# Altium schematic sheet MCU_IMU.SchDoc
size A; SheetNumber: 1; SheetTotal: 4
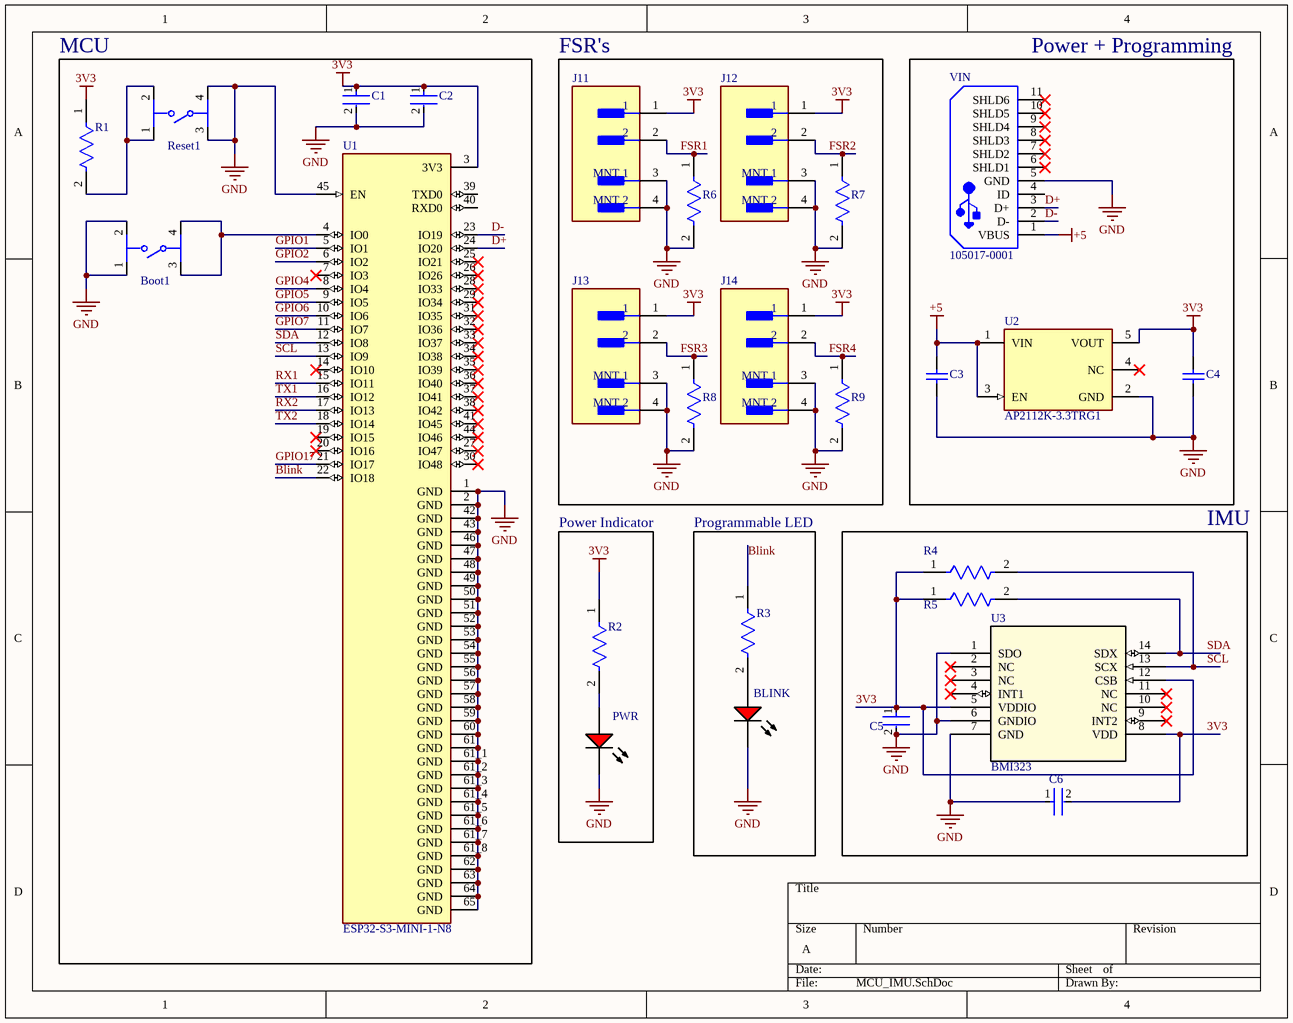
[diagram p0: MCU_IMU.SchDoc]

## Parts
BLINK  SML-LX1206IC-TR  [LUMX-SML-LX1206IC_V]  (value not drawn)
Boot1  PTS810SJM250SMTRLFS  [FP-PTS810SJM250SMTRLFS-MFG]  (value not drawn)
C1  CC0805KRX7R9BB104  [FP-CC0805-0_85-MFG]  (value not drawn)
C2  CC0805KRX7R9BB104  [FP-CC0805-0_85-MFG]  (value not drawn)
C3  C0805C105K5RACTU  [CAPC2013X140X50ML20T25]  (value not drawn)
C4  C0805C105K5RACTU  [CAPC2013X140X50ML20T25]  (value not drawn)
C5  CC0805KRX7R9BB104  [FP-CC0805-0_85-MFG]  (value not drawn)
C6  CC0805KRX7R9BB104  [FP-CC0805-0_85-MFG]  (value not drawn)
J11  BM02B-SRSS-TBT(LF)(SN)  [FP-BM02B-SRSS-TBT_LF_SN-MFG]  (value not drawn)
J12  BM02B-SRSS-TBT(LF)(SN)  [FP-BM02B-SRSS-TBT_LF_SN-MFG]  (value not drawn)
J13  BM02B-SRSS-TBT(LF)(SN)  [FP-BM02B-SRSS-TBT_LF_SN-MFG]  (value not drawn)
J14  BM02B-SRSS-TBT(LF)(SN)  [FP-BM02B-SRSS-TBT_LF_SN-MFG]  (value not drawn)
PWR  SML-LX1206IC-TR  [LUMX-SML-LX1206IC_V]  (value not drawn)
R1  CRCW08054K70FKEA  [FP-CRCW0805-e3-IPC_B]  (value not drawn)
R2  CRCW08054K70FKEA  [FP-CRCW0805-e3-IPC_B]  (value not drawn)
R3  CRCW08054K70FKEA  [FP-CRCW0805-e3-IPC_B]  (value not drawn)
R4  CRCW08054K70FKEA  [FP-CRCW0805-e3-IPC_B]  (value not drawn)
R5  CRCW08054K70FKEA  [FP-CRCW0805-e3-IPC_B]  (value not drawn)
R6  RC0603FR-0710KL  [FP-RC0603-0_55-IPC_C]  (value not drawn)
R7  RC0603FR-0710KL  [FP-RC0603-0_55-IPC_C]  (value not drawn)
R8  RC0603FR-0710KL  [FP-RC0603-0_55-IPC_C]  (value not drawn)
R9  RC0603FR-0710KL  [FP-RC0603-0_55-IPC_C]  (value not drawn)
Reset1  PTS810SJM250SMTRLFS  [FP-PTS810SJM250SMTRLFS-MFG]  (value not drawn)
U1  ESP32-S3-MINI-1-N8  [XCVR_ESP32-S3-MINI-1-N8]
U2  AP2112K-3.3TRG1  [FP-SOT25-IPC_A]
U3  BMI323  [BMI323_BOS]
VIN  105017-0001  [USB-MICRO-B_V]

## Blocks framed on the sheet
MCU: Boot1 C1 C2 R1 Reset1 U1
FSR's: J11-J14 R6-R9
Power + Programming: C3 C4 U2 VIN
Power Indicator: PWR R2
Programmable LED: BLINK R3
IMU: C5 C6 R4 R5 U3

## Nets
3V3: C1.1 C2.1 C4.2 C5.1 C6.2 J11.1 J12.1 J13.1 J14.1 R1.1 R2.1 R4.1 R5.1 U1.3(3V3) U2.5(VOUT) U3.5(VDDIO) U3.8(VDD) U3.12(CSB)
+5: C3.2 U2.1(VIN) U2.3(EN) VIN.1(VBUS)
GND: BLINK.2(K) Boot1.1 Boot1.2 C1.2 C2.2 C3.1 C4.1 C5.2 C6.1 J11.3(MNT_1) J11.4(MNT_2) J12.3(MNT_1) J12.4(MNT_2) J13.3(MNT_1) J13.4(MNT_2) J14.3(MNT_1) J14.4(MNT_2) PWR.2(K) R6.2 R7.2 R8.2 R9.2 Reset1.3 Reset1.4 U1.1(GND) U1.2(GND) U1.42(GND) U1.43(GND) U1.45(EN) U1.46(GND) U1.47(GND) U1.48(GND) U1.49(GND) U1.50(GND) U1.51(GND) U1.52(GND) U1.53(GND) U1.54(GND) U1.55(GND) U1.56(GND) U1.57(GND) U1.58(GND) U1.59(GND) U1.60(GND) U1.61(GND) U1.61_1(GND) U1.61_2(GND) U1.61_3(GND) U1.61_4(GND) U1.61_5(GND) U1.61_6(GND) U1.61_7(GND) U1.61_8(GND) U1.62(GND) U1.63(GND) U1.64(GND) U1.65(GND) U2.2(GND) U3.1(SDO) U3.6(GNDIO) U3.7(GND) VIN.5(GND)
Blink: R3.1 U1.22(IO18)
D+: U1.24(IO20) VIN.3(D+)
D-: U1.23(IO19) VIN.2(D-)
FSR1: J11.2 R6.1
FSR2: J12.2 R7.1
FSR3: J13.2 R8.1
FSR4: J14.2 R9.1
GPIO1: U1.5(IO1)
GPIO2: U1.6(IO2)
GPIO4: U1.8(IO4)
GPIO5: U1.9(IO5)
GPIO6: U1.10(IO6)
GPIO7: U1.11(IO7)
GPIO17: U1.21(IO17)
RX1: U1.15(IO11)
RX2: U1.17(IO13)
SCL: R4.2 U1.13(IO9) U3.13(SCX)
SDA: R5.2 U1.12(IO8) U3.14(SDX)
TX1: U1.16(IO12)
TX2: U1.18(IO14)
NetBLINK_1: BLINK.1(A) R3.2
NetBoot1_3: Boot1.3 Boot1.4 U1.4(IO0)
NetPWR_1: PWR.1(A) R2.2
NetR1_2: R1.2 Reset1.1 Reset1.2

Not connected (* = marked no-connect by the designer): U1 7(IO3)* 14(IO10)* 19(IO15)* 20(IO16)* 25(IO21)* 26(IO26)* 27(IO47)* 28(IO33)* 29(IO34)* 30(IO48)* 31(IO35)* 32(IO36)* 33(IO37)* 34(IO38)* 35(IO39)* 36(IO40)* 37(IO41)* 38(IO42)* 39(TXD0) 40(RXD0) 41(IO45)* 44(IO46)*; U2 4(NC)*; U3 2(NC)* 3(NC)* 4(INT1)* 9(INT2)* 10(NC)* 11(NC)*; VIN 4(ID) 6(SHLD1)* 7(SHLD2)* 8(SHLD3)* 9(SHLD4)* 10(SHLD5)* 11(SHLD6)*

## Library data of the parts
BLINK PWR = CMP-2000-07123-1: LED Red, 65 mW, -40 to 85 degC, 2-Pin SMD, RoHS, Tape and Reel; Manufacturer: Lumex; LED Material: GaAsP; Peak Wavelength: 635nm; Number of LEDs: 1; Viewing Angle: 160; Reverse Voltage: 5(Min)V; Lens Appearance: ColorlessNonDiffused; Intensity: 6mcd; Pin_Count: 2; Lens Dimensions: 2x1.6x0.5mm; Mounting: SurfaceMount; ECCN: EAR99; RoHS: Unknown; Package Description: 2-Pin Surface Mount Device, Body 3.2 x 1.5 mm; Mounting Technology: SurfaceMount; Dominant Wavelength: N/A; Supplier_Package: SMD; Supplier Standard Pack: 3,000; Color: Red; Dimension: 3.2x1.6x1.1mm; HTS: 8541402000; Part No: SML-LX1206IC-TR; Family: SML-LX1206IC; Supplier: Lumex; Datasheet URL: http://www.lumex.com/content/files/ProductAttachment/SML-LX1206IC-TR.pdf; Package Reference: SML-LX1206IC; Manufacturer URL: http://www.lumexinstruments.com/; Type: Uni-Color; Operating Temperature: -25to85C; Packaging: TapeandReel; Datasheet Version: Rev. J, 08/2012
Boot1 Reset1 = CMP-10040-000001-2: SWITCH TACTILE SPST-NO 0.05A 16V; Throw Configuration: SPST; Operating Force: 160gf; Actuator Type: Standard; Switch Travel: 0.15mm; Switch Function: Off-Mom; Max Current Rating: 50mA; Mechanical Life: 150000Cycles; Illumination Type: Non-Illuminated; Package Quantity: 2900; Depth: 4.6mm; Mount: Surface Mount; Packaging: Tape and Reel; Length: 3.2mm; RoHS Compliant: Yes; Case/Package: SMD/SMT; Voltage Rating (DC): 16V; Min Operating Temperature: -40°C; Termination: J-Bend; Lead Free: Lead Free; Contact Plating: Silver; Orientation: Straight; Max Operating Temperature: 85°C; Current Rating: 50mA; Color: Black
C1 C2 C5 C6 = CMP-2100-03606-3: CAP CER 0.1UF 50V X7R 0805; Manufacturer: Yageo; Tolerance: 0.1; Capacitance: 100 nF; Value: 100 nF; Material: Ceramic; Device Class L1: Passive Components; ComponentLink2Description: Datasheet; Package: CC0805-0.85; Manufacturer Part Number: CC0805KRX7R9BB104; Digikey Description: CAP CER 0.1UF 50V X7R 0805; Device Class L3: Ceramic Capacitors; Temperature: -30°C to +85°C; Temperature Characteristic: X7R; Voltage Rating: 50 V; Height: 0.95mm; RoHS: TRUE; Ipc Land Pattern Name: CAPC200125X85; Device Class L2: Capacitors; Category: Cap; Temperature Range Low: -30°C; Temperature Range High: +85°C; Mouser Description: Multilayer Ceramic Capacitors MLCC - SMD/SMT 100nF 50V X7R 10%; Footprint Url: http://www.yageo.com/exep/pages/download/literatures/UPY-C_GEN_24.pdf; Automotive: No; Octopart: https://octopart.com/cc0805krx7r9bb104-yageo-192993; Lead Free: Yes; ComponentLink2URL: http://www.yageo.com/documents/recent/UPY-GPHC_Y5V_6.3V-to-50V_8.pdf
C3 C4 = CMP-2007-03236-1: Manufacturer: Kemet; Part Number: C0805C105K5RACTU
J11-J14 = CMP-17439-000179-1: CONN WIRE HDR 2POS 1MM STSMD; Mated Stacking Heights: 4.9mm; Max Current Rating: 1A; Pitch: 0.039inch; Contact Resistance: 20mR; Max Voltage Rating (DC): 50V; Connector Type: Header; Number of Positions: 2; Insulation Material: Nylon; Termination: Solder; Contact Plating: Tin; Mount: Surface Mount; Package Quantity: 1500; Housing Color: Natural; Orientation: Straight; Max Operating Temperature: 85°C; Min Operating Temperature: -25°C; Length: 4mm; Lead Free: Lead Free; Contact Type: Male Pin; Depth: 3.6mm; Contact Material: Copper Alloy; Packaging: Tape and Reel; Number of Rows: 1; Contact Shape: Square; Flammability Rating: UL94 V-0; Voltage Rating: 50V; Color: Natural; Contact Finish - Mating: TIN; Fastening Type: Pull; Insulation Color: Natural; Series: SR; Max Voltage Rating (AC): 50V; Housing Material: Polyamide
R1-R5 = CMP-2100-03615-2: RES Thick Film, 4.7kΩ, 1%, 0.125W, 100ppm/°C, 0805; Max Power Dissipation: 125mW; Resistance: 4.7kR; Voltage Rating: 150V; Termination: SMD/SMT; Weight: 0.000194oz; Case/Package: 0805; Number of Terminations: 2; Min Operating Temperature: -55°C; Case Code (Metric): 2012; Package Quantity: 10; Depth: 1.25mm; Military Standard: Not; Composition: Thick Film; Radiation Hardening: No; Contact Plating: Tin; Height: 0.45mm; Power Rating: 125mW; Features: Automotive AEC-Q200; Tolerance: 1%; Packaging: Tape and Reel; Max Operating Temperature: 155°C; Length: 2mm; Case Code (Imperial): 0805; Voltage Rating (DC): 150V; Width: 1.25mm; Temperature Coefficient: 100ppm/°C; Lead Free: Lead Free
R6-R9 = CMP-2100-03664-2: RES 10K OHM 1% 1/10W 0603; Voltage Rating: 75V; Voltage Rating (DC): 50V; Resistance: 10kR; Power Rating: 100mW; Temperature Coefficient: 100ppm/°C; Depth: 0.8mm; Termination: SMD/SMT; Resistor Type: Thick Film; Series: RC; Construction: Rectangular; Features: Moisture Resistant; Packaging: Tape and Reel; Min Operating Temperature: -55°C; Number of Terminations: 2; Lead Pitch: 0.3mm; RoHS Compliant: Yes; Case/Package: 0603; Resistance Tolerance: 1%; Military Standard: Not; Weight: 7.1E-05oz; Number of Pins: 2; Tolerance: 1%; Length: 1.6mm; Case Code (Imperial): 0603; Lead Free: Lead Free; Width: 0.8mm; Max Power Dissipation: 100mW; Height: 0.45mm; Max Operating Temperature: 155°C; Case Code (Metric): 1608; Size Code: 0603
U1 = CMP-025-000000-2: MF: {'manufacturer': u'Espressif Systems'}; Pin Count: 73; Component Type: Standard; Design Item ID: ESP32-S3-MINI-1-N8; Source: ESP32-S3-MINI-1-N8.SchLib; MP: ESP32-S3-MINI-1-N8; Price: None; Package: None; Value: *
U2 = CMP-12756-000035-1: IC REG LINEAR 3.3V 600MA SOT25; Number of Regulators: 1; Output Type: Fixed; Polarity: Positive; Min Input Voltage: 2.5V; Max Input Voltage: 6V; Accuracy: 1.5%; Quiescent Current: 55uA; Dropout Voltage: 250mV; Min Operating Temperature: -40°C; Length: 3.1mm; Output Current: 600mA; Max Operating Temperature: 85°C; Package Quantity: 1; Output Voltage: 3.3V; Width: 1.7mm; Number of Outputs: 1; Packaging: Tape and Reel; Height: 1.3mm; Lead Free: Lead Free; Max Output Current: 600mA; Case/Package: SOT-23-5; Mount: Surface Mount; Number of Pins: 5
U3 = BMI323: No Description Available; Manufacturer_Name: Bosch Sensortec; Copyright: Copyright (C) 2025 Ultra Librarian. All rights reserved.; Manufacturer_Part_Number: BMI323; RefDes: RefDes; Type: Type
VIN = CMP-2000-05827-1: Micro-USB B Receptacle, Right Angle, Bottom Mount, Surface Mount, with Solder Tabs, -30 to 85 degC, 5-Pin USB, RoHS, Tape and Reel; Manufacturer: Molex; Featured Product: Micro-USBConnectorsUSBConnectors; Other Names: WM1399DKR; Package Version: Rev. F, 12/2012; Number of Contacts: 5; Connector Type: USB-microB; Catalog Drawings: 1050170001; 3D Model: 105017-0001.stp; Mating Products: WM17145-ND-CABLEMICROUSBBTOSTDA1.0MWM17147-ND-CABLEMICROUSBBTOSTDA2.0MWM17146-ND-CABLEMICROUSBBTOSTDA1.5M; PCN Assembly/Origin: ResinSupplier21/Oct/2015; Voltage - Max: 30V; Online Catalog: Molex-MicroUSB; Manufacturer URL: http://www.molex.com/; Package Description: 5-Leads USB, Micro B, Body 7.5 x 5 mm, Pitch 0.65 mm; Datasheet URL: http://www.molex.com/elqNow/elqRedir.htm?ref=http://www.molex.com/webdocs/datasheets/pdf/en-us/1050170001_IO_CONNECTORS.pdf; Ingress Protection: -; Datasheet Version: 03/2016; Mounting Type: BoardCutout,SurfaceMount,RightAngle; Circuits: 5; Standard Package: 1; Package Reference: MICRO-B; Package URL: http://www.molex.com/pdm_docs/sd/1050170001_sd.pdf; Category: Connectors,Interconnects; Series: -; RoHS Information: 1050170001CertofCompliance; Features: Shielded,SolderRetention; Family: USB,DVI,HDMIConnectors; Specifications: -; Gender: Receptacle; Packaging: Digi-Reel®; Mounting Technology: SurfaceMount